# Altium schematic sheet TCRT5000COM.SchDoc
size A4
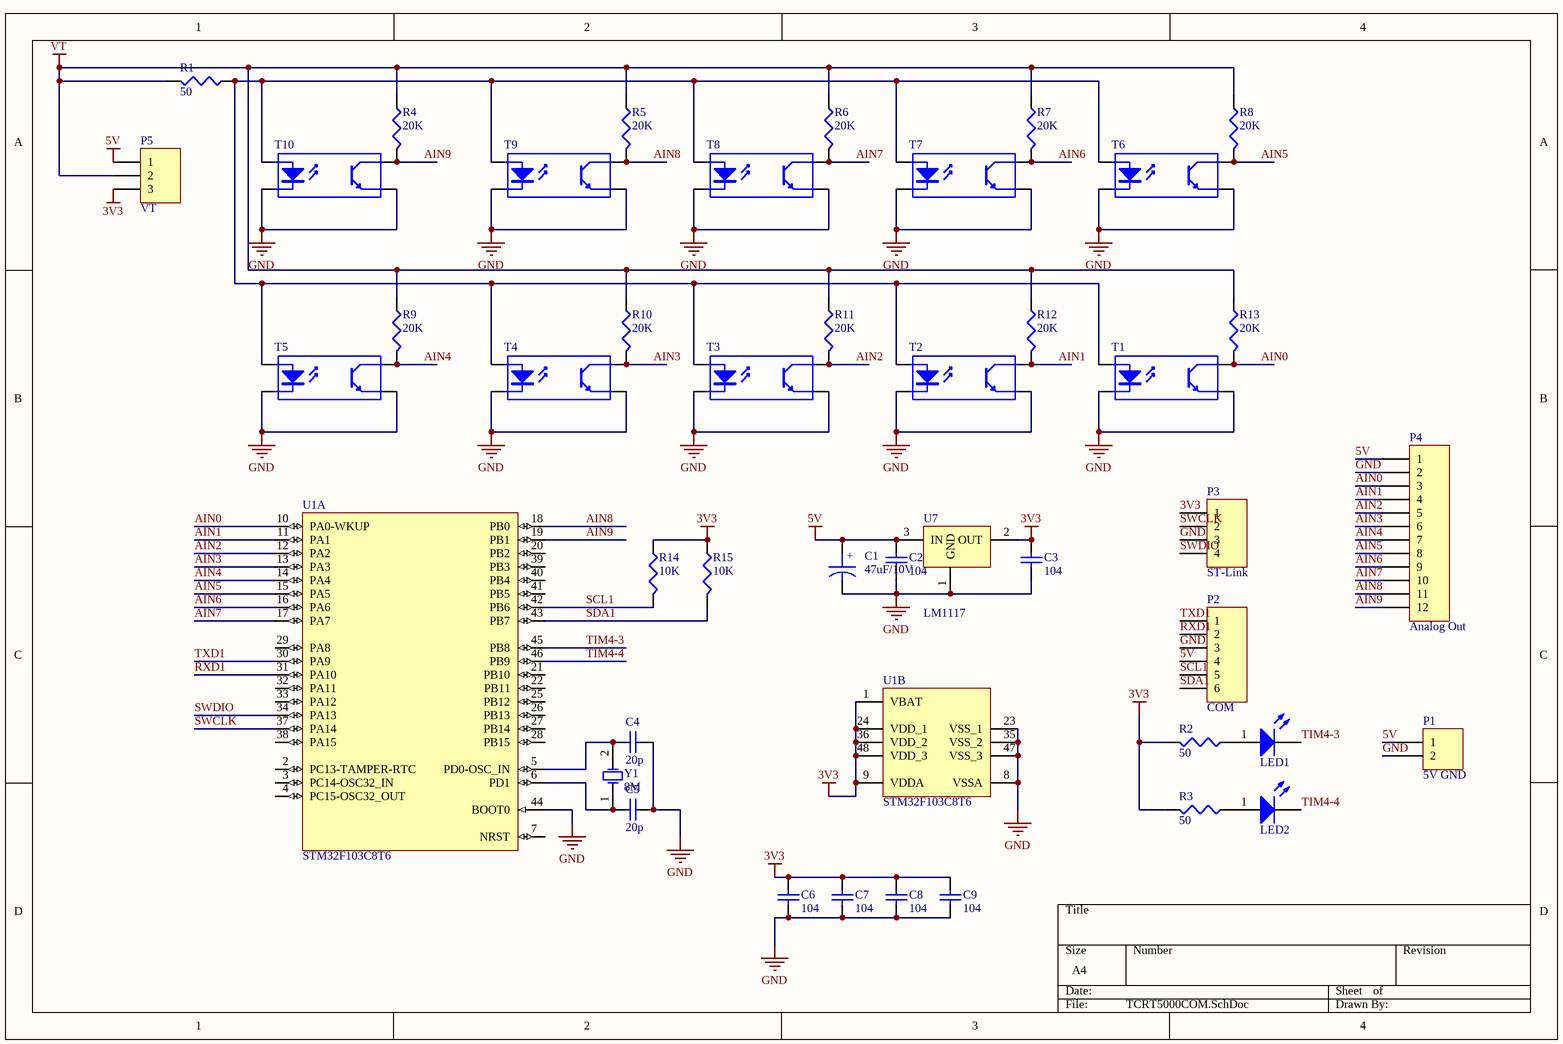
[diagram p0: TCRT5000COM.SchDoc]

## Parts
C1  47uF/10V  [RB2]
C2  value 104  [0603]  (hidden comment: Cap)
C3  value 104  [0603]  (hidden comment: Cap)
C4  20p  [0603]
C5  20p  [0603]
C6  value 104  [0603]  (hidden comment: Cap)
C7  value 104  [0603]  (hidden comment: Cap)
C8  value 104  [0603]  (hidden comment: Cap)
C9  value 104  [0603]  (hidden comment: Cap)
LED1  LED-white  [LED-white]  (value not drawn)
LED2  LED-white  [LED-white]  (value not drawn)
P1  5V GND  [SIP2-150]
P2  COM  [HDR1X6]
P3  ST-Link  [HDR1X4]
P4  Analog Out  [HDR1X12]
P5  VT  [HDR1X3]
R1  value 50  [0603]  (hidden comment: Res3)
R2  value 50  [0603]  (hidden comment: Res3)
R3  value 50  [0603]  (hidden comment: Res3)
R4  value 20K  [0603]  (hidden comment: Res3)
R5  value 20K  [0603]  (hidden comment: Res3)
R6  value 20K  [0603]  (hidden comment: Res3)
R7  value 20K  [0603]  (hidden comment: Res3)
R8  value 20K  [0603]  (hidden comment: Res3)
R9  value 20K  [0603]  (hidden comment: Res3)
R10  value 20K  [0603]  (hidden comment: Res3)
R11  value 20K  [0603]  (hidden comment: Res3)
R12  value 20K  [0603]  (hidden comment: Res3)
R13  value 20K  [0603]  (hidden comment: Res3)
R14  value 10K  [0603]  (hidden comment: Res3)
R15  value 10K  [0603]  (hidden comment: Res3)
T1  Optoisolator1  [TCRT5000]  (value not drawn)
T2  Optoisolator1  [TCRT5000]  (value not drawn)
T3  Optoisolator1  [TCRT5000]  (value not drawn)
T4  Optoisolator1  [TCRT5000]  (value not drawn)
T5  Optoisolator1  [TCRT5000]  (value not drawn)
T6  Optoisolator1  [TCRT5000]  (value not drawn)
T7  Optoisolator1  [TCRT5000]  (value not drawn)
T8  Optoisolator1  [TCRT5000]  (value not drawn)
T9  Optoisolator1  [TCRT5000]  (value not drawn)
T10  Optoisolator1  [TCRT5000]  (value not drawn)
U1  STM32F103C8T6  [QUAD48]  (parts A,B of 2)
U7  LM1117  [SPP3]
Y1  8M  [XTAL1]

## Nets
3V3: C3.2 C6.2 C7.2 C8.2 C9.2 P3.1 P5.3 R2.2 R3.2 R14.1 R15.1 U1.1(VBAT) U1.9(VDDA) U1.24(VDD_1) U1.36(VDD_2) U1.48(VDD_3) U7.2(OUT)
5V: C1.1 C2.2 P1.1 P2.4 P4.1 P5.1 U7.3(IN)
GND: C1.2 C2.1 C3.1 C4.2 C5.2 C6.1 C7.1 C8.1 C9.1 P1.2 P2.3 P3.3 P4.2 T1.2(K) T1.3(E) T2.2(K) T2.3(E) T3.2(K) T3.3(E) T4.2(K) T4.3(E) T5.2(K) T5.3(E) T6.2(K) T6.3(E) T7.2(K) T7.3(E) T8.2(K) T8.3(E) T9.2(K) T9.3(E) T10.2(K) T10.3(E) U1.8(VSSA) U1.23(VSS_1) U1.35(VSS_2) U1.44(BOOT0) U1.47(VSS_3) U7.1(GND)
VT: P5.2 R1.2 R4.1 R5.1 R6.1 R7.1 R8.1 R9.1 R10.1 R11.1 R12.1 R13.1
AIN0: P4.3 R13.2 T1.4(C) U1.10(PA0-WKUP)
AIN1: P4.4 R12.2 T2.4(C) U1.11(PA1)
AIN2: P4.5 R11.2 T3.4(C) U1.12(PA2)
AIN3: P4.6 R10.2 T4.4(C) U1.13(PA3)
AIN4: P4.7 R9.2 T5.4(C) U1.14(PA4)
AIN5: P4.8 R8.2 T6.4(C) U1.15(PA5)
AIN6: P4.9 R7.2 T7.4(C) U1.16(PA6)
AIN7: P4.10 R6.2 T8.4(C) U1.17(PA7)
AIN8: P4.11 R5.2 T9.4(C) U1.18(PB0)
AIN9: P4.12 R4.2 T10.4(C) U1.19(PB1)
RXD1: P2.2 U1.31(PA10)
SCL1: P2.5 R14.2 U1.42(PB6)
SDA1: P2.6 R15.2 U1.43(PB7)
SWCLK: P3.2 U1.37(PA14)
SWDIO: P3.4 U1.34(PA13)
TIM4-3: LED1.2(K) U1.45(PB8)
TIM4-4: LED2.2(K) U1.46(PB9)
TXD1: P2.1 U1.30(PA9)
NetC4_1: C4.1 U1.5(PD0-OSC_IN) Y1.2(OSC2)
NetC5_1: C5.1 U1.6(PD1) Y1.1(OSC1)
NetLED1_1: LED1.1(A) R2.1
NetLED2_1: LED2.1(A) R3.1
NetR1_1: R1.1 T1.1(A) T2.1(A) T3.1(A) T4.1(A) T5.1(A) T6.1(A) T7.1(A) T8.1(A) T9.1(A) T10.1(A)

Not connected (* = marked no-connect by the designer): U1 2(PC13-TAMPER-RTC) 3(PC14-OSC32_IN) 4(PC15-OSC32_OUT) 7(NRST) 20(PB2) 21(PB10) 22(PB11) 25(PB12) 26(PB13) 27(PB14) 28(PB15) 29(PA8) 32(PA11) 33(PA12) 38(PA15) 39(PB3) 40(PB4) 41(PB5)

## Notes on the sheet
- (in symbol CAP POL) +

## Library data of the parts
C1 = CAP POL: Text Field1: 20; Text Field2: 20
C2-C9 = Cap: Capacitor; Published: 8-Jun-2000; LatestRevisionDate: 17-Jul-2002; LatestRevisionNote: Re-released for DXP Platform.; Publisher: Altium Limited
  C2 C3 C6-C9: PackageReference: RAD-0.3; PackageDescription: Radial Cap, Thru-Hole; 2 Leads; 0.3 in Pin Spacing
  C4 C5: Value: 20p
LED1 LED2 = LED-white: Typical INFRARED GaAs LED; Published: 8-Jun-2000; Revision: July-2002: Re-released for DXP Platform.; Publisher: Altium Limited
P1 = Header 2: Header, 2-Pin; LatestRevisionDate: 17-Jul-2002; LatestRevisionNote: Re-released for DXP Platform.; Publisher: Altium Limited
P2 = Header 6: Header, 6-Pin; LatestRevisionDate: 17-Jul-2002; LatestRevisionNote: Re-released for DXP Platform.; Publisher: Altium Limited
P3 = Header 4: Header, 4-Pin; LatestRevisionDate: 17-Jul-2002; LatestRevisionNote: Re-released for DXP Platform.; Publisher: Altium Limited
P4 = Header 12: Header, 12-Pin; LatestRevisionDate: 17-Jul-2002; LatestRevisionNote: Re-released for DXP Platform.; Publisher: Altium Limited
P5 = Header 3: Header, 3-Pin; LatestRevisionDate: 17-Jul-2002; LatestRevisionNote: Re-released for DXP Platform.; Publisher: Altium Limited
R1-R15 = Res3: Resistor; Published: 8-Jun-2000; LatestRevisionDate: 29-May-2009; LatestRevisionNote: IPC-7351 Footprint Added.; PackageReference: J1-0603; Publisher: Altium Limited; PackageDescription: Chip Resistor
T1-T10 = Optoisolator1: 4-Pin Phototransistor Optocoupler; Published: 24-Mar-1999; LatestRevisionDate: 04-Mar-2005; LatestRevisionNote: Sch pins 3 & 4 Swapped.; DatasheetVersion: Nov-2003; PackageReference: DIP-4; Publisher: Altium Limited
U1 = STM32F103C8T6: STM32 ARM-based 32-bit MCU Performance Line with 64 kB Flash, 20 kB Internal RAM, -40 to +85癈 Temperature, 48-Pin LQFP, Tray; DatasheetVersion: rev13.0, Apr-2011; PackageVersion: rev13, Apr-2011; PackageReference: LQFP48; PackageDescription: 48-Pin Low-Profile Quad Flat Pack, 7 x 7 mm Body, 0.5 mm Pitch (LQFP48); ComponentLink1Description: Manufacturer URL; ComponentLink1URL: http://www.st.com/; ComponentLink2Description: STM32F103 Datasheet; ComponentLink2URL: http://www.st.com/internet/com/TECHNICAL_RESOURCES/TECHNICAL_LITERATURE/DATASHEET/CD00161566.pdf; ComponentLink3Description: STM32 Family Web Page; ComponentLink3URL: www.st.com/stm32
Y1 = XTAL: Crystal Oscillator; Published: 8-Jun-2000; LatestRevisionDate: 17-Jul-2002; LatestRevisionNote: Re-released for DXP Platform.; Publisher: Altium Limited